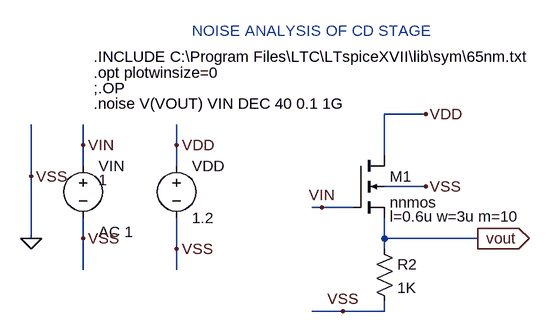
[diagram p0: schematic 12NOISE ANALYSIS OF CD STAGE.asc]
12NOISE ANALYSIS OF CD STAGE.asc, the LTspice schematic file:
Version 4
SHEET 1 880 680
WIRE 416 96 352 96
WIRE -112 144 -112 112
WIRE 32 144 32 112
WIRE 352 160 352 96
WIRE -112 176 -112 144
WIRE 32 176 32 144
WIRE -192 192 -192 112
WIRE 416 208 352 208
WIRE 256 240 240 240
WIRE 304 240 256 240
WIRE -192 288 -192 192
WIRE -112 288 -112 256
WIRE 352 288 352 256
WIRE 496 288 352 288
WIRE 32 304 32 256
WIRE 352 304 352 288
WIRE -112 336 -112 288
WIRE 32 336 32 304
WIRE 288 400 240 400
WIRE 352 400 352 384
WIRE 352 400 288 400
FLAG -192 288 0
FLAG -192 192 VSS
FLAG -112 288 VSS
FLAG 32 304 VSS
FLAG 416 208 VSS
FLAG 32 144 VDD
FLAG -112 144 VIN
FLAG 256 240 VIN
FLAG 496 288 vout
IOPIN 496 288 Out
FLAG 416 96 VDD
FLAG 288 400 VSS
SYMBOL nmos4 304 160 R0
WINDOW 123 56 94 Left 2
SYMATTR Value2 l=0.6u w=3u m=10
SYMATTR InstName M1
SYMATTR Value nnmos
SYMBOL voltage 32 160 R0
SYMATTR InstName VDD
SYMATTR Value 1.2
SYMBOL voltage -112 160 R0
WINDOW 123 24 118 Left 2
WINDOW 39 0 0 Left 0
WINDOW 3 24 38 Left 2
SYMATTR Value2 AC 1
SYMATTR InstName VIN
SYMATTR Value 1
SYMBOL res 336 288 R0
SYMATTR InstName R2
SYMATTR Value 1K
TEXT -96 8 Left 2 !.INCLUDE C:\\Program Files\\LTC\\LTspiceXVII\\lib\\sym\\65nm.txt
TEXT -96 32 Left 2 !.opt plotwinsize=0
TEXT -96 56 Left 2 !;.OP
TEXT -96 80 Left 2 !.noise V(VOUT) VIN DEC 40 0.1 1G
TEXT 56 -32 Left 2 ;NOISE ANALYSIS OF CD STAGE

The netlist it stands for:
* 12NOISE ANALYSIS OF CD STAGE.asc
M1 VDD VIN vout 0 nnmos l=0.6u w=3u m=10
VDD VDD 0 1.2
VIN VIN 0 1 AC 1
R2 vout 0 1K
.model NMOS NMOS
.model PMOS PMOS
.lib standard.mos
.INCLUDE C:\Program Files\LTC\LTspiceXVII\lib\sym\65nm.txt
.opt plotwinsize=0
;.OP
.noise V(VOUT) VIN DEC 40 0.1 1G
* NOISE ANALYSIS OF CD STAGE
.backanno
.end